# Altium schematic sheet Motor_2.SchDoc
size A; SheetNumber: 3; SheetTotal: 4
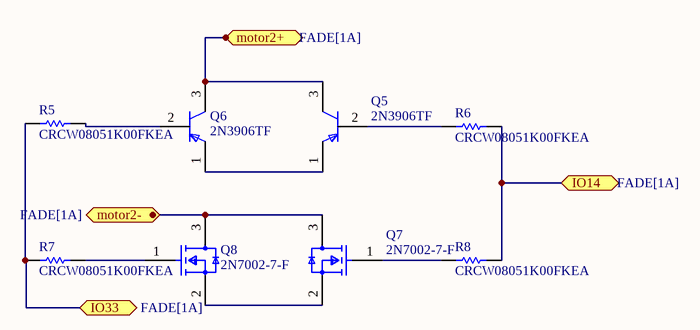
[diagram p0: Motor_2.SchDoc]

## Parts
Q5  2N3906TF  [FP-135AR-MFG]
Q6  2N3906TF  [FP-135AR-MFG]
Q7  2N7002-7-F  [FP-SOT23-MFG]
Q8  2N7002-7-F  [FP-SOT23-MFG]
R5  CRCW08051K00FKEA  [RESC2013X50X30NL20T20]
R6  CRCW08051K00FKEA  [RESC2013X50X30NL20T20]
R7  CRCW08051K00FKEA  [RESC2013X50X30NL20T20]
R8  CRCW08051K00FKEA  [RESC2013X50X30NL20T20]

## Ports
IO14 (bidir, see FADE[1A]), IO33 (bidir, see FADE[1A]), motor2+ (bidir, see FADE[1A]), motor2- (bidir, see FADE[1A])

## Nets
IO14: R6.2 R8.2 ; port IO14
IO33: R5.1 R7.1 ; port IO33
motor2+: Q5.3(C) Q6.3(C) ; port motor2+
motor2-: Q7.3(D) Q8.3(D) ; port motor2-
NetQ5_1: Q5.1(E) Q6.1(E)
NetQ5_2: Q5.2(B) R6.1
NetQ6_2: Q6.2(B) R5.2
NetQ7_1: Q7.1(G) R8.1
NetQ7_2: Q7.2(S) Q8.2(S)
NetQ8_1: Q8.1(G) R7.2

## Library data of the parts
Q5 Q6 = CMP-00278-84408866-1: 2N3906TF Small Signal Bipolar Transistor, 0.2A I(C), 40V V(BR)CEO, 1-Element, PNP, Silicon, TO-92; Manufacturer Lifecycle Status: ACTIVE; Collector Base Voltage (VCBO): -40V; Frequency: 250MHz; Number of Elements: 1; Max Power Dissipation: 625mW; Max Breakdown Voltage: 160V; Current Rating: -200mA; Emitter Base Voltage (VEBO): -5V; Collector Emitter Saturation Voltage: -400mV; Element Configuration: Single; Max Junction Temperature (Tj): 150°C; hFE Min: 100; Polarity: PNP; Lead Free: Lead Free; RoHS: Compliant; Max Operating Temperature: 150°C; Collector Emitter Voltage (VCEO): -40V; Max Frequency: 250MHz; Power Dissipation: 625mW; Height: 5.33mm; Schedule B: 8541210080; Mount: Through Hole; Length: 5.2mm; REACH SVHC: No SVHC; Min Operating Temperature: -55°C; Gain Bandwidth Product: 250MHz; Number of Pins: 3; Lifecycle Status: Production; Transition Frequency: 250MHz; NexarPartId: 84408866; Collector Emitter Breakdown Voltage: -40V; Case/Package: TO-92; Packaging: Tape and Reel; Width: 4.19mm; Max Collector Current: -200mA; Radiation Hardening: No; Weight: 240mg; Voltage Rating (DC): -40V
Q7 Q8 = CMP-2000-04929-2: MOSFET N-CH 60V 115MA SOT23-3; Turn-On Delay Time: 7ns; Turn-Off Delay Time: 11ns; Drain to Source Resistance: 7.5R; Rise Time: 3ns; Drain to Source Breakdown Voltage: 70V; Input Capacitance: 50pF; Number of Elements: 1; Power Dissipation: 540mW; Max Power Dissipation: 300mW; Fall Time: 5.6ns; Gate to Source Voltage (Vgs): 20V; Threshold Voltage: 2.5V; Element Configuration: Single; Termination: SMD/SMT; Weight: 0.000282oz; Radiation Hardening: No; Max Operating Temperature: 150°C; On-State Resistance: 7.5R; Mount: Surface Mount; Current Rating: 115mA; Contact Plating: Tin; Lead Free: Lead Free; Min Operating Temperature: -55°C; Number of Pins: 3; REACH SVHC: No SVHC; Drain to Source Voltage (Vdss): 60V; Width: 1.3mm; Package Quantity: 3000; Length: 2.9mm; Case/Package: SOT-23; Number of Channels: 1; Dual Supply Voltage: 60V; Packaging: Tape and Reel; Height: 1mm; Voltage Rating (DC): 60V; Nominal Vgs: 2.5V; Continuous Drain Current (ID): 115mA; Voltage: 60V; Rds On Max: 7.5R
R5-R8 = CMP-1013-00510-2: Manufacturer: Vishay Dale; Part Number: CRCW08051K00FKEA